# Altium schematic sheet GPS.SchDoc
size B; Organization: ORGANIZATION; Address1: ADDRESS 1; Address2: ADDRESS 2; Address3: ADDRESS 3; Address4: ADDRESS 4; Revision: -; SheetNumber: 6; SheetTotal: 7; ENG_APP_DATE: --/--/--; DSN_APP_DATE: --/--/--; CHK_APP_DATE: --/--/--
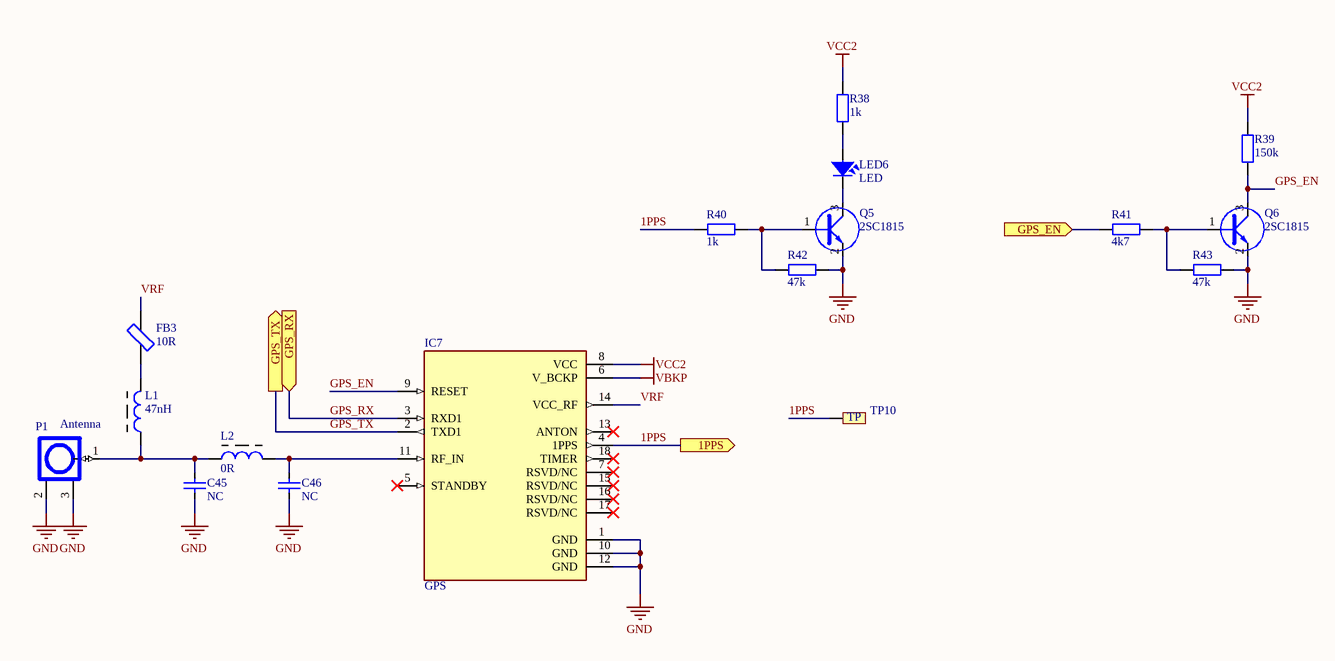
[diagram p0: GPS.SchDoc]

## Parts
C45  NC  [CAP_0805]
C46  NC  [CAP_0805]
FB3  10R  [RES-SMD-0805]
IC7  GPS  [L70]
L1  47nH  [L-0805]
L2  0R  [L-0805]
LED6  LED  [LED-0805-Orange]
P1  Antenna  [IPXS]
Q5  2SC1815  [SOT23D]
Q6  2SC1815  [SOT23D]
R38  1k  [RES-SMD-0603]
R39  150k  [RES-SMD-0603]
R40  1k  [RES-SMD-0603]
R41  4k7  [RES-SMD-0603]
R42  47k  [RES-SMD-0603]
R43  47k  [RES-SMD-0603]
TP10  TP  [TP_SMD]  (value not drawn)

## Ports
1PPS (out), GPS_EN (in), GPS_RX (in), GPS_TX (out)

## Nets
GND: C45.1 C46.1 IC7.1(GND) IC7.10(GND) IC7.12(GND) P1.2 P1.3 Q5.2(E) Q6.2(E) R42.1 R43.1
VBKP: IC7.6(V_BCKP)
VCC2: IC7.8(VCC) R38.1 R39.1
1PPS: IC7.4(1PPS) R40.2 TP10.1 ; port 1PPS
GPS_EN: IC7.9(RESET) Q6.3(C) R39.2
GPS_EN: R41.2 ; port GPS_EN  [a separate net that carries the same name]
GPS_RX: IC7.3(RXD1) ; port GPS_RX
GPS_TX: IC7.2(TXD1) ; port GPS_TX
VRF: FB3.2 IC7.14(VCC_RF)
NetC45_2: C45.2 L1.1 L2.1 P1.1
NetC46_2: C46.2 IC7.11(RF_IN) L2.2
NetFB3_1: FB3.1 L1.2
NetLED6_1: LED6.1 R38.2
NetLED6_2: LED6.2 Q5.3(C)
NetQ5_1: Q5.1(B) R40.1 R42.2
NetQ6_1: Q6.1(B) R41.1 R43.2

Not connected (* = marked no-connect by the designer): IC7 5(STANDBY)* 7(RSVD/NC)* 13(ANTON)* 15(RSVD/NC)* 16(RSVD/NC)* 17(RSVD/NC)* 18(TIMER)*

## Notes on the sheet
- DWG. NO.
- REV.
- SHT.
- THIS DOCUMENT AND THE DATA DISCLOSED HEREIN OR HEREWITH IS THE PROPERTY OF ALTIUM LIMITED AND MAY BE FREELY DISTRIBUTED IN WHOLE. NO RIGHTS ARE RESERVED OR EXPRESS OR IMPLIED WARANTEE GIVEN.
- REVISION
- DESCRIPTION
- DATE
- APPROVED
- ENG:
- APPROVALS
- PROJECT
- DSN:
- CHK:
- REFERENCE DOCUMENTS
- PROJECT REVISION:
- TITLE
- DOCUMENT REVISION:
- DESIGN ITEM:
- BOM:
- FAB DWG:
- PCB DWG:
- ASSY DWG:
- SCALE:
- SIZE
- B
- CAGE CODE
- FILE NAME
- DWG NO.
- SHEET
- OF
- REV

## Library data of the parts
C45 C46 = CapSMD: Capacitor; Value: 33p; Published: 8-Jun-2000; LatestRevisionDate: 17-Jul-2002; LatestRevisionNote: Re-released for DXP Platform.; PackageReference: RAD-0.3; Publisher: Altium Limited
FB3 = Ferrit Bead: Generic Ferrit Bead
IC7 = L70: Quectel GPS IC
L1 L2 = Inductor Ferit: Inductor; Value: 150 mH
LED6 = LED: LED Single colour Green and Red; Value: LED 3 ly Single Colour
P1 = IPXSx66: Antenna GSM GPS
Q5 Q6 = C1815: NPN 600mW, ECB; Value: C1815
R38-R43 = Resistor - SMD: Resistor SMD; Manufacturer: Generic Components; Class: Passive; Published: 08/06/2000; Publisher: Altium Hobart Technology Centre
TP10 = TP: CONNECT 1